# Altium schematic sheet uart_adm3222.SchDoc
size A4
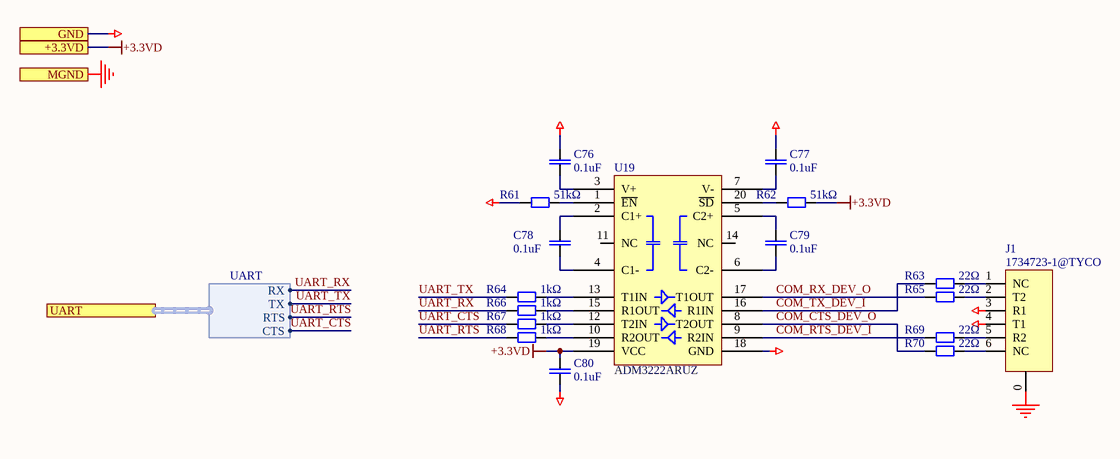
[diagram p0: uart_adm3222.SchDoc]

## Parts
C76  0.1uF  [CAPC2012N]
C77  0.1uF  [CAPC2012N]
C78  0.1uF  [CAPC2012N]
C79  0.1uF  [CAPC2012N]
C80  0.1uF  [CAPC2012N]
J1  1734723-1@TYCO  [RJ14]
R61  51kΩ  [RESC2012N]
R62  51kΩ  [RESC2012N]
R63  22Ω  [RESC1608N]
R64  1kΩ  [RESC2012N]
R65  22Ω  [RESC1608N]
R66  1kΩ  [RESC2012N]
R67  1kΩ  [RESC2012N]
R68  1kΩ  [RESC2012N]
R69  22Ω  [RESC1608N]
R70  22Ω  [RESC1608N]
U19  ADM3222ARUZ  [SOP65P640X110-20N]

## Ports
+3.3VD, GND, MGND, UART (harness UART)

## Harnesses
UART: RX, TX, RTS, CTS

## Nets
+3.3VD: C80.2 R62.2 U19.19(VCC) ; port +3.3VD
GND: C76.2 C77.2 C80.1 J1.3(R1) J1.4(T1) R61.1 U19.18(GND) ; port GND
MGND: J1.0 ; port MGND
COM_CTS_DEV_O: R70.1 U19.8(T2OUT)
COM_RTS_DEV_I: R69.1 U19.9(R2IN)
COM_RX_DEV_O: R65.1 U19.17(T1OUT)
COM_TX_DEV_I: R63.1 U19.16(R1IN)
UART_CTS: R67.1 ; port UART.CTS
UART_RTS: R68.1 ; port UART.RTS
UART_RX: R66.1 ; port UART.RX
UART_TX: R64.1 ; port UART.TX
NetC76_1: C76.1 U19.3(V+)
NetC77_1: C77.1 U19.7(V-)
NetC78_1: C78.1 U19.4(C1-)
NetC78_2: C78.2 U19.2(C1+)
NetC79_1: C79.1 U19.6(C2-)
NetC79_2: C79.2 U19.5(C2+)
NetJ1_1: J1.1(NC) R63.2
NetJ1_2: J1.2(T2) R65.2
NetJ1_5: J1.5(R2) R69.2
NetJ1_6: J1.6(NC) R70.2
NetR61_2: R61.2 U19.1(~{EN})
NetR62_1: R62.1 U19.20(~{SD})
NetR64_2: R64.2 U19.13(T1IN)
NetR66_2: R66.2 U19.15(R1OUT)
NetR67_2: R67.2 U19.12(T2IN)
NetR68_2: R68.2 U19.10(R2OUT)

Not connected (* = marked no-connect by the designer): U19 11(NC) 14(NC)

## Library data of the parts
C76-C80 = CAPC: Generic ceramic SMD capacitor; Pkg: 0805; Maintainer: Evgeniy Kotov; SMD Solders: 2; THD Solders: 0; PartField: 0.1uF; Last Change Data: 06.03.2017; Release Date: 06.03.2017; Value: 0.1uF
J1 = RJ-14: Pkg: RJ14-6p; SMD Solders: 0; THD Solders: 10; PartField: 1734723-1@TYCO; Value: 1734723-1@TYCO
R61 R62 R64 R66-R68 = RESC: Resistor, Generic, SMD; Pkg: 0805; Maintainer: Evgeniy Kotov; SMD Solders: 2; THD Solders: 0; Release Date: 06.03.2017; Last Change Data: 09.03.2017
  R61 R62: PartField: 51kΩ; Value: 51kΩ
  R64 R66-R68: PartField: 1kΩ; Value: 1kΩ
R63 R65 R69 R70 = RESC: Resistor, Generic, SMD; Pkg: 0603; Maintainer: Evgeniy Kotov; SMD Solders: 2; THD Solders: 0; PartField: 22Ω; Release Date: 06.03.2017; Last Change Data: 09.03.2017; Value: 22Ω
U19 = ADM3222ARU: RS232; Pkg: TSSOP-20; SMD Solders: 20; THD Solders: 0; Vendor: Analog Devices; ComponentLink1URL: https://www.analog.com/media/en/technical-documentation/data-sheets/ADM3202_3222_1385.pdf; Last Change Date: 24.05.2019; PartField: ADM3222ARUZ; Value: ADM3222